# Altium schematic sheet rf_bpf.SchDoc: mcHF QRP Transceiver RF board
size A4; Author: K Atanassov; CompanyName: M0NKA; Revision: 0.6.3; SheetTotal: 12
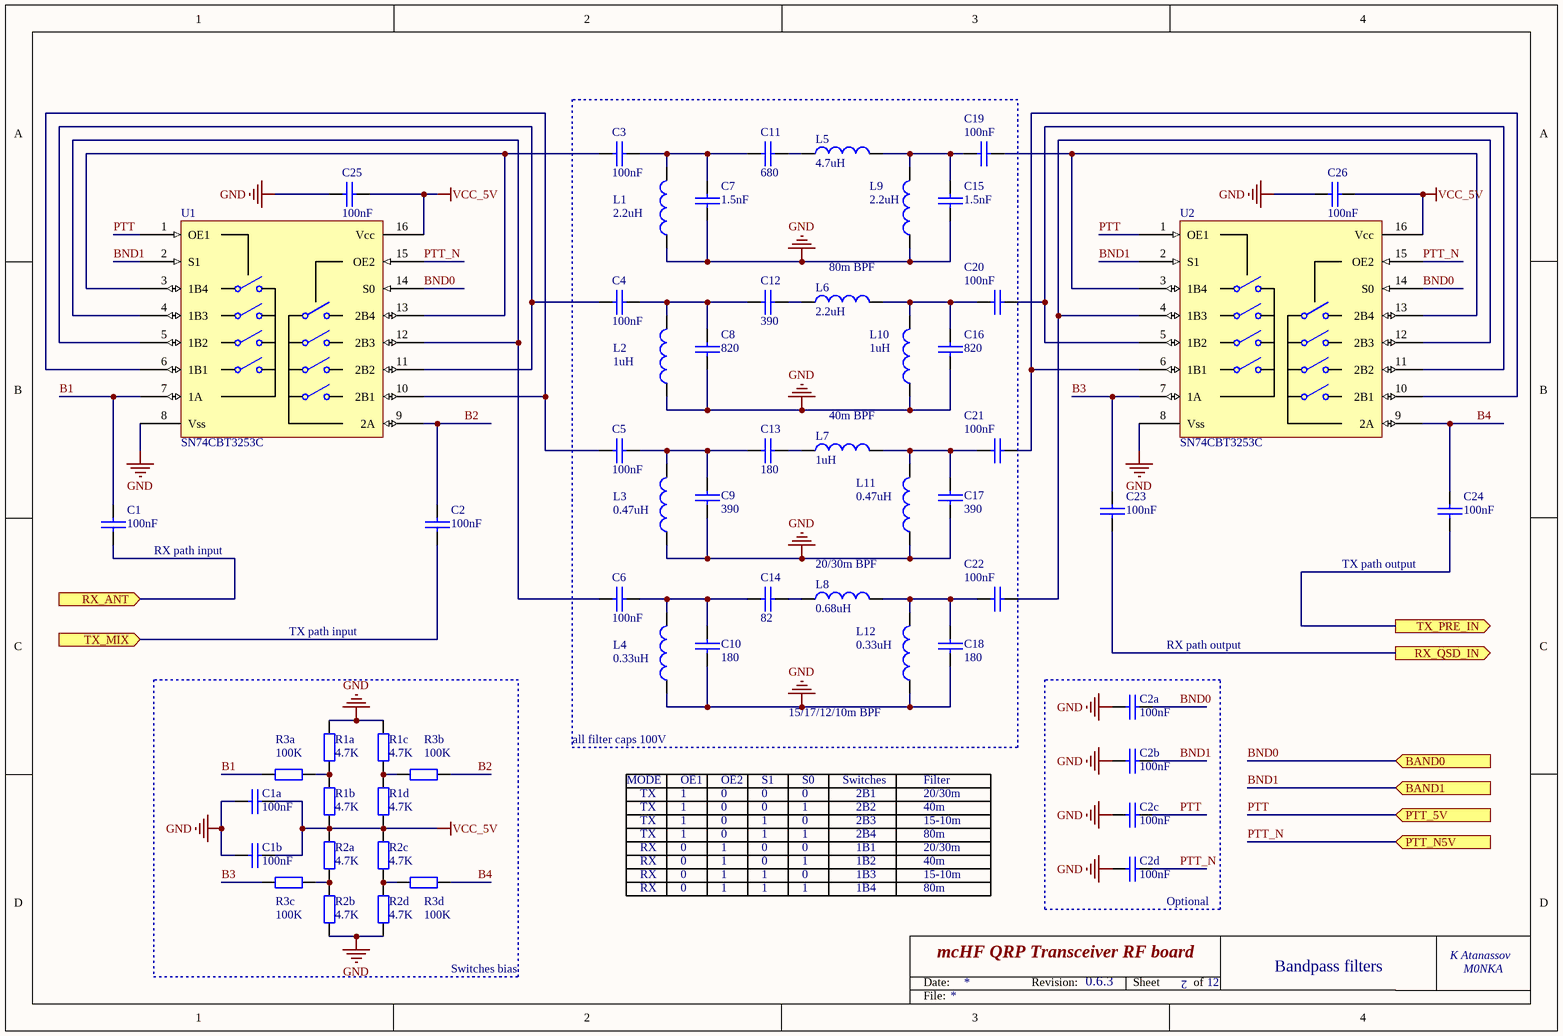
[diagram p0: rf_bpf.SchDoc]

## Parts
C1  100nF  [0805-Pro]
C1a  100nF  [0805-Pro]
C1b  100nF  [0805-Pro]
C2  100nF  [0805-Pro]
C2a  100nF  [0805-Pro]
C2b  100nF  [0805-Pro]
C2c  100nF  [0805-Pro]
C2d  100nF  [0805-Pro]
C3  100nF  [0805-Pro]
C4  100nF  [0805-Pro]
C5  100nF  [0805-Pro]
C6  100nF  [0805-Pro]
C7  1.5nF  [0805-Pro]
C8  820  [0805-Pro]
C9  390  [0805-Pro]
C10  180  [0805-Pro]
C11  680  [0805-Pro]
C12  390  [0805-Pro]
C13  180  [0805-Pro]
C14  82  [0805-Pro]
C15  1.5nF  [0805-Pro]
C16  820  [0805-Pro]
C17  390  [0805-Pro]
C18  180  [0805-Pro]
C19  100nF  [0805-Pro]
C20  100nF  [0805-Pro]
C21  100nF  [0805-Pro]
C22  100nF  [0805-Pro]
C23  100nF  [0805-Pro]
C24  100nF  [0805-Pro]
C25  100nF  [0805-Pro]
C26  100nF  [0805-Pro]
L1  2.2uH  [0805-Pro]
L2  1uH  [0805-Pro]
L3  0.47uH  [0805-Pro]
L4  0.33uH  [0805-Pro]
L5  4.7uH  [0805-Pro]
L6  2.2uH  [0805-Pro]
L7  1uH  [0805-Pro]
L8  0.68uH  [0805-Pro]
L9  2.2uH  [0805-Pro]
L10  1uH  [0805-Pro]
L11  0.47uH  [0805-Pro]
L12  0.33uH  [0805-Pro]
R1a  4.7K  [0805-Pro]
R1b  4.7K  [0805-Pro]
R1c  4.7K  [0805-Pro]
R1d  4.7K  [0805-Pro]
R2a  4.7K  [0805-Pro]
R2b  4.7K  [0805-Pro]
R2c  4.7K  [0805-Pro]
R2d  4.7K  [0805-Pro]
R3a  100K  [0805-Pro]
R3b  100K  [0805-Pro]
R3c  100K  [0805-Pro]
R3d  100K  [0805-Pro]
U1  SN74CBT3253C  [SO-16-Pro]
U2  SN74CBT3253C  [SO-16-Pro]

## Blocks framed on the sheet
Switches bias: C1a C1b R1a R1b R1c R1d R2a R2b R2c R2d R3a R3b R3c R3d
Optional: C2a C2b C2c C2d

## Ports
BAND0 (in), BAND1 (in), PTT_5V (in), PTT_N5V (in), RX_ANT (in), RX_QSD_IN (out), TX_MIX (in), TX_PRE_IN (out)

## Nets
GND: C1a.2 C1b.2 C2a.2 C2b.2 C2c.2 C2d.2 C7.2 C8.2 C9.1 C10.1 C15.2 C16.2 C17.1 C18.1 C25.2 C26.2 L1.1 L2.1 L3.1 L4.1 L9.1 L10.1 L11.1 L12.1 R1a.1 R1c.1 R2b.2 R2d.2 U1.8(Vss) U2.8(Vss)
VCC_5V: C1a.1 C1b.1 C25.1 C26.1 R1b.2 R1d.2 R2a.1 R2c.1 U1.16(Vcc) U2.16(Vcc)
B1: C1.2 R3a.1 U1.7(1A)
B2: C2.2 R3b.2 U1.9(2A)
B3: C23.2 R3c.1 U2.7(1A)
B4: C24.2 R3d.2 U2.9(2A)
BND0: C2a.1 U1.14(S0) U2.14(S0) ; port BAND0
BND1: C2b.1 U1.2(S1) U2.2(S1) ; port BAND1
PTT: C2c.1 U1.1(OE1) U2.1(OE1) ; port PTT_5V
PTT_N: C2d.1 U1.15(OE2) U2.15(OE2) ; port PTT_N5V
RX_ANT: C1.1 ; port RX_ANT
RX_QSD_IN: C23.1 ; port RX_QSD_IN
TX_MIX: C2.1 ; port TX_MIX
TX_PRE_IN: C24.1 ; port TX_PRE_IN
NetC3_1: C3.1 C7.1 C11.1 L1.2
NetC3_2: C3.2 U1.3(1B4) U1.13(2B4)
NetC4_1: C4.1 C8.1 C12.1 L2.2
NetC4_2: C4.2 U1.5(1B2) U1.11(2B2)
NetC5_1: C5.1 C9.2 C13.1 L3.2
NetC5_2: C5.2 U1.6(1B1) U1.10(2B1)
NetC6_1: C6.1 C10.2 C14.1 L4.2
NetC6_2: C6.2 U1.4(1B3) U1.12(2B3)
NetC11_2: C11.2 L5.1
NetC12_2: C12.2 L6.1
NetC13_2: C13.2 L7.1
NetC14_2: C14.2 L8.1
NetC15_1: C15.1 C19.2 L5.2 L9.2
NetC16_1: C16.1 C20.2 L6.2 L10.2
NetC17_2: C17.2 C21.2 L7.2 L11.2
NetC18_2: C18.2 C22.2 L8.2 L12.2
NetC19_1: C19.1 U2.3(1B4) U2.13(2B4)
NetC20_1: C20.1 U2.5(1B2) U2.11(2B2)
NetC21_1: C21.1 U2.6(1B1) U2.10(2B1)
NetC22_1: C22.1 U2.4(1B3) U2.12(2B3)
NetR1a_2: R1a.2 R1b.1 R3a.2
NetR1c_2: R1c.2 R1d.1 R3b.1
NetR2a_2: R2a.2 R2b.1 R3c.2
NetR2c_2: R2c.2 R2d.1 R3d.1

## Notes on the sheet
- (near L6) 80m BPF
- (near L7) 40m BPF
- (near C1) RX path input
- 20/30m BPF
- (near C24) TX path output
- TX path input
- RX path output
- (near L12) 15/17/12/10m BPF
- all filter caps 100V
- MODE
- OE1
- OE2
- S1
- S0
- Switches
- Filter
- TX
- RX
- 1
- 0
- 2B1
- 2B2
- 2B4
- 2B3
- 1B1
- 20/30m
- 40m
- 15-10m
- 80m
- 1B2
- 1B3
- 1B4
- 2
- Bandpass filters
- Date:
- Revision:
- Sheet
- of
- File:

## Library data of the parts
C1 C1a C1b C2 C2a C2b C2c C2d C3-C6 C19-C26 = CAP: Capacitor; Order: FN 252-2090; QT Order: QCC-00154; Price: 0.068
C7 C15 = CAP: Capacitor; Order: FN 221-0934; Price: 0.124
C8 C16 = CAP: Capacitor; Order: FN 174-0649; QT Order: QCC-00147; Price: 0.074
C9 C12 C17 = CAP: Capacitor; Order: FN 233-2701; QT Order: QCC-00125; Price: 0.078
C10 C13 C18 = CAP: Capacitor; Order: FN 233-2756; QT Order: QCC-00084; Price: 0.058
C11 = CAP: Capacitor; Order: FN 228-0662; Price: 0.074
C14 = CAP: Capacitor; Order: FN 174-0656; QT Order: QCC-00069; Price: 0.074
L1 L6 L9 = BPF_IND: INDUCTOR SMD; Order: FN 166-9889; Price: 0.166
L2 L7 L10 = BPF_IND: INDUCTOR SMD; Order: FN 166-9882; Price: 0.166
L3 L11 = BPF_IND: INDUCTOR SMD; Order: FN 166-9913; Price: 0.166
L4 L12 = BPF_IND: INDUCTOR SMD; Order: FN 166-9911; Price: 0.166
L5 = BPF_IND: INDUCTOR SMD; Order: FN 249-1624; Price: 0.166
L8 = BPF_IND: INDUCTOR SMD; Order: FN 166-9915; Price: 0.166
R1a R1b R1c R1d R2a R2b R2c R2d = RES: Resistor; Order: FN 200-8383; QT Order: QCR-00341; Price: 0.024
R3a R3b R3c R3d = RES: Resistor; Order: FN 146-9860; QT Order: QCR-00373; Price: 0.021
U1 U2 = SN74CBT3253C: Dual 4:1 Demux/Analog Switch; Order: FN 175-0447; Price: 0.69